# EAGLE design H01 (EAGLE 6.6.0)
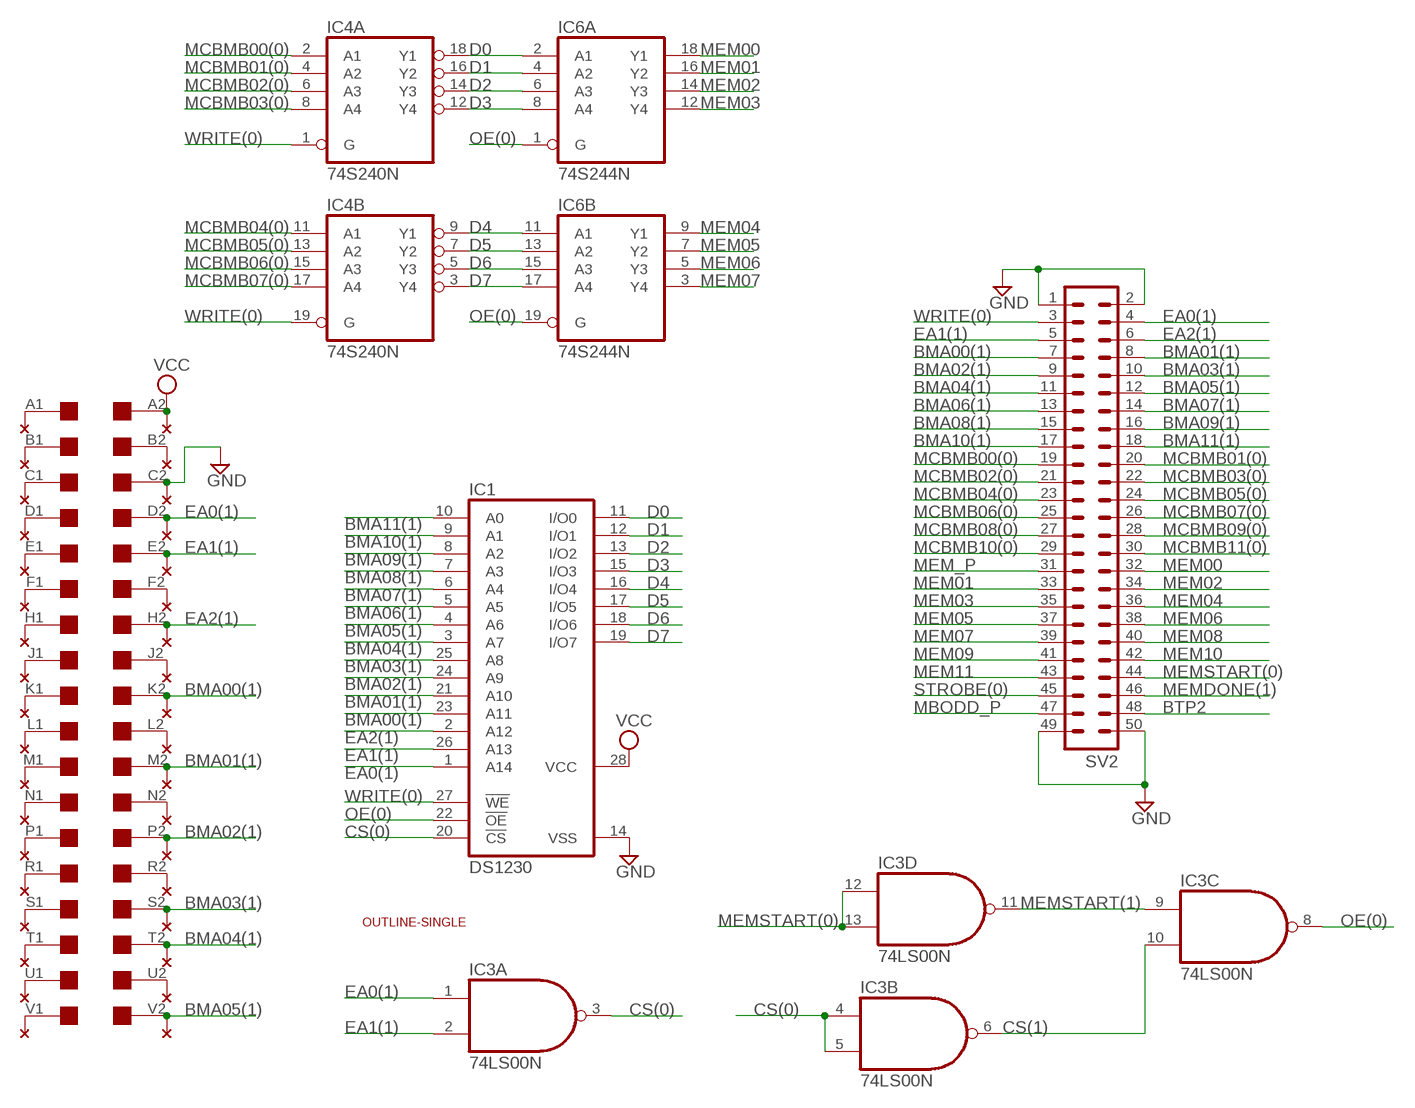
[diagram p0: schematic, sheet 1]

## Parts
EDGE1  EDGE-2CONNECTOR  [EDGE-CON2]
IC1  DS1230  62256P  [DIL28-6]
IC3  74LS00N  [DIL14]
IC4  74S240N  [DIL20]
IC6  74S244N  [DIL20]
SV2  ML50L  [ML50L]
U$2  OUTLINE-SINGLE  [SINGLE]
U$3  THRU-HOLE2  [THRU-HOLEB]

## Nets
BMA00(1): EDGE1.K2 IC1.23(A11) SV2.7 U$3.K2
BMA01(1): EDGE1.M2 IC1.21(A10) SV2.8 U$3.M2
BMA02(1): EDGE1.P2 IC1.24(A9) SV2.9 U$3.P2
BMA03(1): EDGE1.S2 IC1.25(A8) SV2.10 U$3.S2
BMA04(1): EDGE1.T2 IC1.3(A7) SV2.11 U$3.T2
BMA05(1): EDGE1.V2 IC1.4(A6) SV2.12 U$3.V2
BMA06(1): IC1.5(A5) SV2.13
BMA07(1): IC1.6(A4) SV2.14
BMA08(1): IC1.7(A3) SV2.15
BMA09(1): IC1.8(A2) SV2.16
BMA10(1): IC1.9(A1) SV2.17
BMA11(1): IC1.10(A0) SV2.18
BTP2: SV2.48
CS(0): IC1.20(!CS) IC3.3(A:O) IC3.4(B:I0) IC3.5(B:I1)
CS(1): IC3.6(B:O) IC3.10(C:I1)
D0: IC1.11(I/O0) IC4.18(A:Y1) IC6.2(A:A1)
D1: IC1.12(I/O1) IC4.16(A:Y2) IC6.4(A:A2)
D2: IC1.13(I/O2) IC4.14(A:Y3) IC6.6(A:A3)
D3: IC1.15(I/O3) IC4.12(A:Y4) IC6.8(A:A4)
D4: IC1.16(I/O4) IC4.9(B:Y1) IC6.11(B:A1)
D5: IC1.17(I/O5) IC4.7(B:Y2) IC6.13(B:A2)
D6: IC1.18(I/O6) IC4.5(B:Y3) IC6.15(B:A3)
D7: IC1.19(I/O7) IC4.3(B:Y4) IC6.17(B:A4)
EA0(1): EDGE1.D2 IC1.1(A14) IC3.1(A:I0) SV2.4 U$3.D2
EA1(1): EDGE1.E2 IC1.26(A13) IC3.2(A:I1) SV2.5 U$3.E2
EA2(1): EDGE1.H2 IC1.2(A12) SV2.6 U$3.H2
GND: EDGE1.C2 IC1.14(VSS) SV2.1 SV2.2 SV2.49 SV2.50 U$3.C2
MBODD_P: SV2.47
MCBMB00(0): IC4.2(A:A1) SV2.19
MCBMB01(0): IC4.4(A:A2) SV2.20
MCBMB02(0): IC4.6(A:A3) SV2.21
MCBMB03(0): IC4.8(A:A4) SV2.22
MCBMB04(0): IC4.11(B:A1) SV2.23
MCBMB05(0): IC4.13(B:A2) SV2.24
MCBMB06(0): IC4.15(B:A3) SV2.25
MCBMB07(0): IC4.17(B:A4) SV2.26
MCBMB08(0): SV2.27
MCBMB09(0): SV2.28
MCBMB10(0): SV2.29
MCBMB11(0): SV2.30
MEM00: IC6.18(A:Y1) SV2.32
MEM01: IC6.16(A:Y2) SV2.33
MEM02: IC6.14(A:Y3) SV2.34
MEM03: IC6.12(A:Y4) SV2.35
MEM04: IC6.9(B:Y1) SV2.36
MEM05: IC6.7(B:Y2) SV2.37
MEM06: IC6.5(B:Y3) SV2.38
MEM07: IC6.3(B:Y4) SV2.39
MEM08: SV2.40
MEM09: SV2.41
MEM10: SV2.42
MEM11: SV2.43
MEM_P: SV2.31
MEMDONE(1): SV2.46
MEMSTART(0): IC3.12(D:I0) IC3.13(D:I1) SV2.44
MEMSTART(1): IC3.9(C:I0) IC3.11(D:O)
N$1: EDGE1.L2 U$3.L2
N$3: EDGE1.N2 U$3.N2
N$5: EDGE1.R2 U$3.R2
N$9: EDGE1.J2 U$3.J2
N$11: EDGE1.F2 U$3.F2
N$15: EDGE1.U2 U$3.U2
N$17: EDGE1.B2 U$3.B2
N$19: EDGE1.K1 U$3.K1
N$20: EDGE1.L1 U$3.L1
N$21: EDGE1.M1 U$3.M1
N$22: EDGE1.N1 U$3.N1
N$23: EDGE1.P1 U$3.P1
N$24: EDGE1.R1 U$3.R1
N$25: EDGE1.S1 U$3.S1
N$26: EDGE1.T1 U$3.T1
N$27: EDGE1.U1 U$3.U1
N$28: EDGE1.V1 U$3.V1
N$29: EDGE1.J1 U$3.J1
N$30: EDGE1.H1 U$3.H1
N$31: EDGE1.F1 U$3.F1
N$32: EDGE1.E1 U$3.E1
N$33: EDGE1.D1 U$3.D1
N$34: EDGE1.C1 U$3.C1
N$35: EDGE1.B1 U$3.B1
N$36: EDGE1.A1 U$3.A1
OE(0): IC1.22(!OE) IC3.8(C:O) IC6.1(A:G) IC6.19(B:G)
STROBE(0): SV2.45
VCC: EDGE1.A2 IC1.28(VCC) U$3.A2
WRITE(0): IC1.27(!WE) IC4.1(A:G) IC4.19(B:G) SV2.3

## Power pins joined to a net without a drawn wire
GND: IC3.7(P:GND) IC4.10(P:GND) IC6.10(P:GND)
VCC: IC3.14(P:VCC) IC4.20(P:VCC) IC6.20(P:VCC)

## Library data of the parts
EDGE1 = dec-con:EDGE-2: Double-Sided DEC edge connector.
IC1 = memory-hitachi:62256P: MEMORY; OC_FARNELL: unknown; OC_NEWARK: unknown
IC3 = 74xx-us:74*00: Quad 2-input NAND gate
IC4 = 74xx-us:74*240: Octal BUFFER and LINE DRIVER, 3-state
IC6 = 74xx-us:74*244: Octal BUFFER and LINE DRIVER, 3-state
SV2 = con-ml:ML50L: HARTING; OC_FARNELL: unknown; OC_NEWARK: unknown
U$2 = dec-con:OUTLINE-*: Board outlines for DEC boards.
U$3 = dec-con:THRU-HOLE2: Thru-Hole addition to double-sided edge connector.

## Board
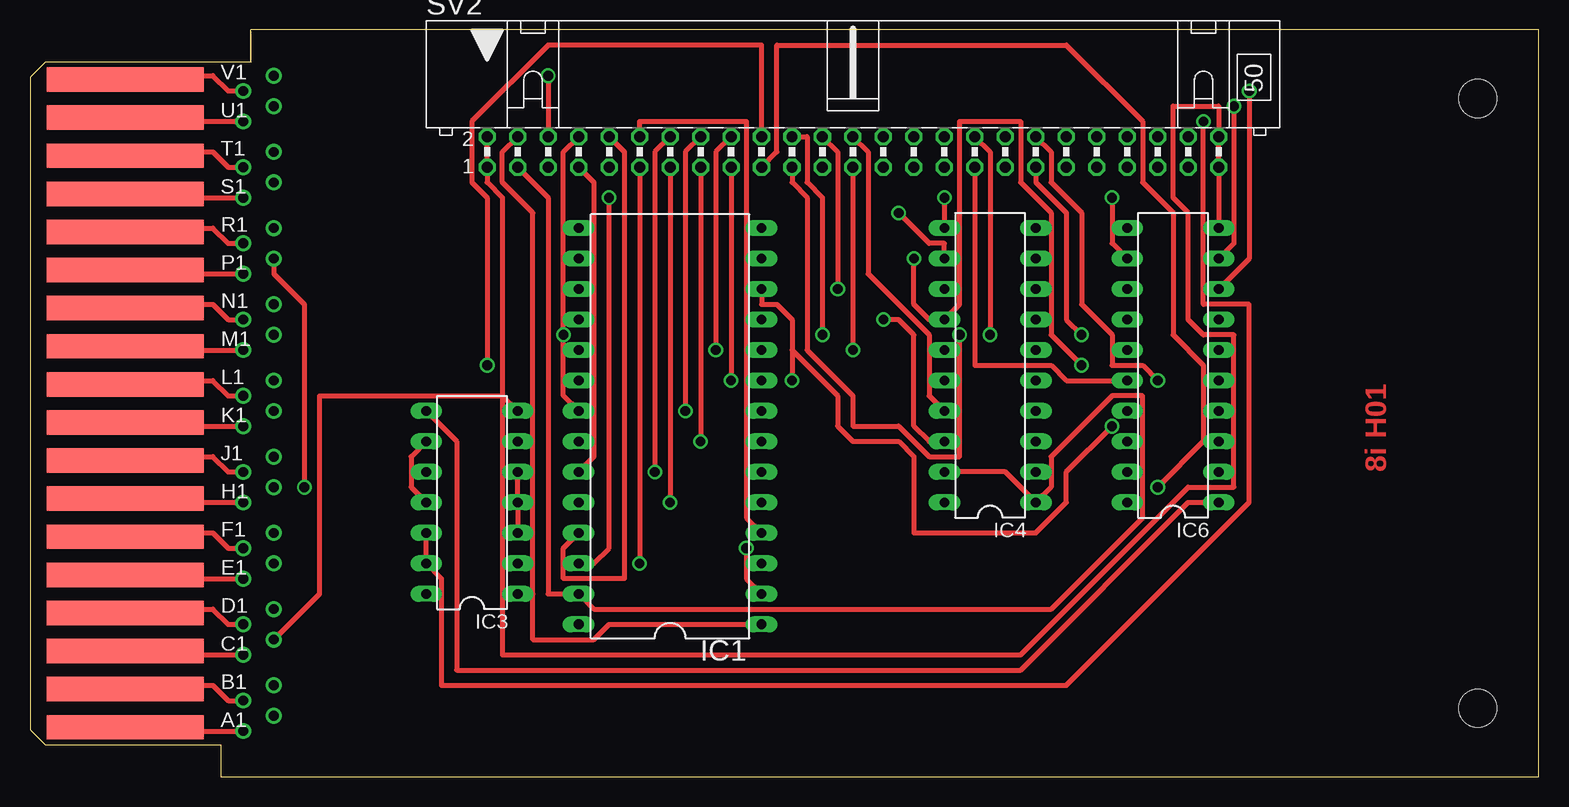
[diagram p1: board, top side]
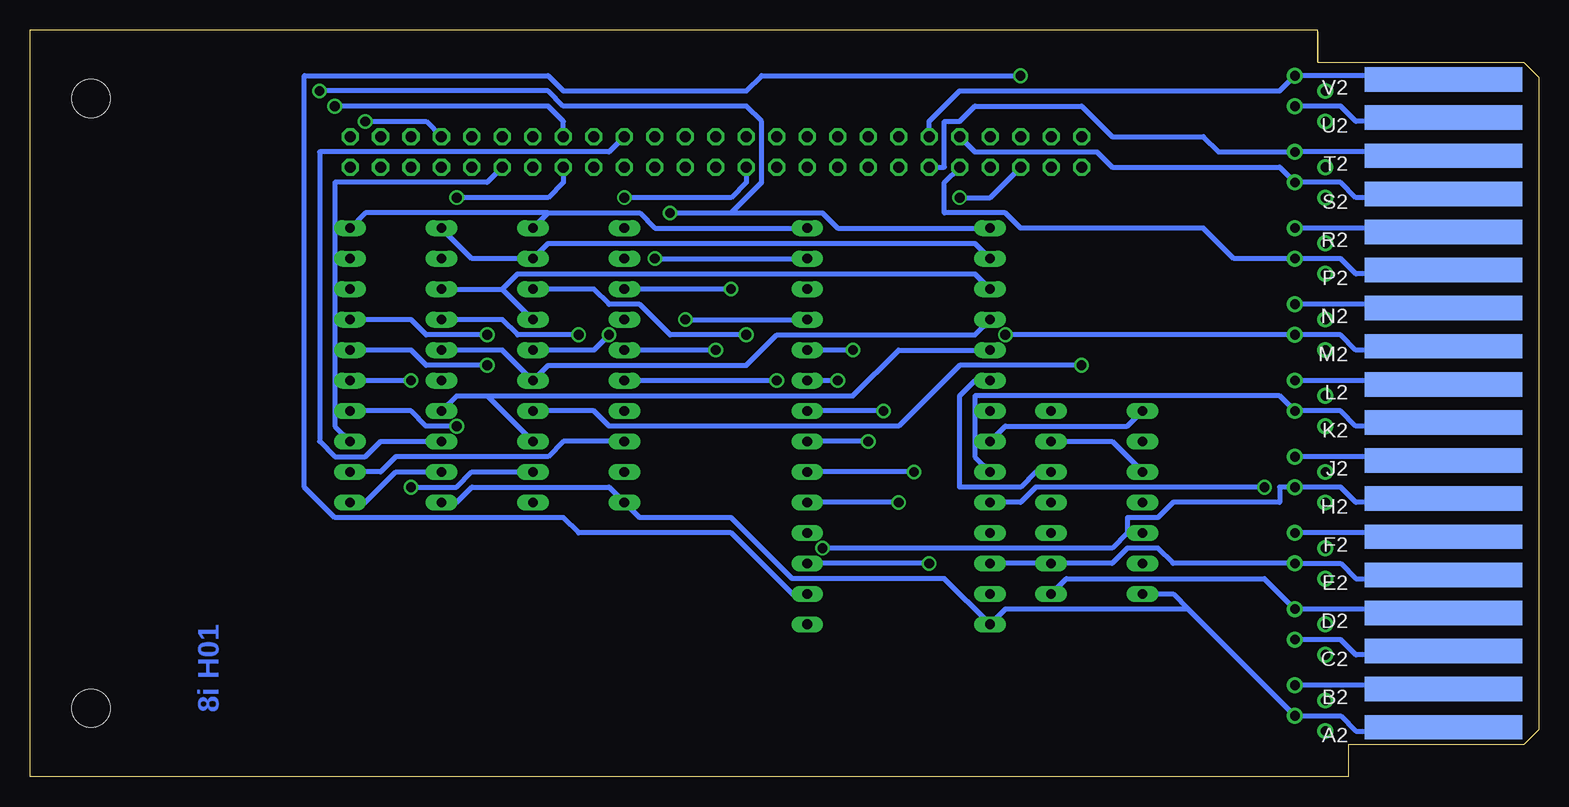
[diagram p2: board, bottom side, seen from below]

Size 125.73 x 62.23 mm. Coordinates in mm from the lower left corner, seen from the top.
Copper layers (1+16): Top 0.035mm / dielectric 1.5mm / Bottom 0.035mm
Design rules "16mils": minimum track width 16mil, minimum drill 32mil, track to track 15mil, track to pad 10mil, pad to pad 10mil, via to via 10mil, smd to smd 10mil, copper to edge 13mil, drill to drill 10mil, minimum pad ring 10mil, minimum via ring 8mil, stop-mask expansion 0mil, vias tented up to drill 0mil, thermal gap 10mil

### Footprints (pad centres in the part's own frame; a part is rotated, then mirrored left to right if it is on the bottom)
EDGE-CON2 = smd 13.106 x 2.032: A1 7.938,4.128; B1 7.938,7.303; C1 7.938,10.477; D1 7.938,13.652; E1 7.938,16.828; F1 7.938,20.003; H1 7.938,23.177; J1 7.938,26.352; K1 7.938,29.527; L1 7.938,32.703; M1 7.938,35.877; N1 7.938,39.053; P1 7.938,42.227; R1 7.938,45.403; S1 7.938,48.578; T1 7.938,51.752; U1 7.938,54.928; V1 7.938,58.102 | smd 13.106 x 2.032 bottom: A2 7.938,4.128; B2 7.938,7.303; C2 7.938,10.477; D2 7.938,13.652; E2 7.938,16.828; F2 7.938,20.003; H2 7.938,23.177; J2 7.938,26.352; K2 7.938,29.527; L2 7.938,32.703; M2 7.938,35.877; N2 7.938,39.053; P2 7.938,42.227; R2 7.938,45.403; S2 7.938,48.578; T2 7.938,51.752; U2 7.938,54.928; V2 7.938,58.102
DIL28-6 = drill 0.813 long: 1 -16.51,-7.62; 2 -13.97,-7.62; 3 -11.43,-7.62; 4 -8.89,-7.62; 5 -6.35,-7.62; 6 -3.81,-7.62; 7 -1.27,-7.62; 8 1.27,-7.62; 9 3.81,-7.62; 10 6.35,-7.62; 11 8.89,-7.62; 12 11.43,-7.62; 13 13.97,-7.62; 14 16.51,-7.62; 15 16.51,7.62; 16 13.97,7.62; 17 11.43,7.62; 18 8.89,7.62; 19 6.35,7.62; 20 3.81,7.62; 21 1.27,7.62; 22 -1.27,7.62; 23 -3.81,7.62; 24 -6.35,7.62; 25 -8.89,7.62; 26 -11.43,7.62; 27 -13.97,7.62; 28 -16.51,7.62
DIL14 = drill 0.813 long: 1 -7.62,-3.81; 2 -5.08,-3.81; 3 -2.54,-3.81; 4 0,-3.81; 5 2.54,-3.81; 6 5.08,-3.81; 7 7.62,-3.81; 8 7.62,3.81; 9 5.08,3.81; 10 2.54,3.81; 11 0,3.81; 12 -2.54,3.81; 13 -5.08,3.81; 14 -7.62,3.81
DIL20 = drill 0.813 long: 1 -11.43,-3.81; 2 -8.89,-3.81; 3 -6.35,-3.81; 4 -3.81,-3.81; 5 -1.27,-3.81; 6 1.27,-3.81; 7 3.81,-3.81; 8 6.35,-3.81; 9 8.89,-3.81; 10 11.43,-3.81; 11 11.43,3.81; 12 8.89,3.81; 13 6.35,3.81; 14 3.81,3.81; 15 1.27,3.81; 16 -1.27,3.81; 17 -3.81,3.81; 18 -6.35,3.81; 19 -8.89,3.81; 20 -11.43,3.81
ML50L = drill 0.914 octagon: 1 -30.48,-1.27; 2 -30.48,1.27; 3 -27.94,-1.27; 4 -27.94,1.27; 5 -25.4,-1.27; 6 -25.4,1.27; 7 -22.86,-1.27; 8 -22.86,1.27; 9 -20.32,-1.27; 10 -20.32,1.27; 11 -17.78,-1.27; 12 -17.78,1.27; 13 -15.24,-1.27; 14 -15.24,1.27; 15 -12.7,-1.27; 16 -12.7,1.27; 17 -10.16,-1.27; 18 -10.16,1.27; 19 -7.62,-1.27; 20 -7.62,1.27; 21 -5.08,-1.27; 22 -5.08,1.27; 23 -2.54,-1.27; 24 -2.54,1.27; 25 0,-1.27; 26 0,1.27; 27 2.54,-1.27; 28 2.54,1.27; 29 5.08,-1.27; 30 5.08,1.27; 31 7.62,-1.27; 32 7.62,1.27; 33 10.16,-1.27; 34 10.16,1.27; 35 12.7,-1.27; 36 12.7,1.27; 37 15.24,-1.27; 38 15.24,1.27; 39 17.78,-1.27; 40 17.78,1.27; 41 20.32,-1.27; 42 20.32,1.27; 43 22.86,-1.27; 44 22.86,1.27; 45 25.4,-1.27; 46 25.4,1.27; 47 27.94,-1.27; 48 27.94,1.27; 49 30.48,-1.27; 50 30.48,1.27
SINGLE = hole 3.175: 120.65,56.515; 120.65,5.715
THRU-HOLEB = drill 0.813 pad 1.27: A1 17.78,3.81; A2 20.32,5.08; B1 17.78,6.35; B2 20.32,7.62; C1 17.78,10.16; C2 20.32,11.43; D1 17.78,12.7; D2 20.32,13.97; E1 17.78,16.51; E2 20.32,17.78; F1 17.78,19.05; F2 20.32,20.32; H1 17.78,22.86; H2 20.32,24.13; J1 17.78,25.4; J2 20.32,26.67; K1 17.78,29.21; K2 20.32,30.48; L1 17.78,31.75; L2 20.32,33.02; M1 17.78,35.56; M2 20.32,36.83; N1 17.78,38.1; N2 20.32,39.37; P1 17.78,41.91; P2 20.32,43.18; R1 17.78,44.45; R2 20.32,45.72; S1 17.78,48.26; S2 20.32,49.53; T1 17.78,50.8; T2 20.32,52.07; U1 17.78,54.61; U2 20.32,55.88; V1 17.78,57.15; V2 20.32,58.42

### Placement (x,y rotation side)
EDGE1  0,0 0 top
IC1  53.34,29.21 90 top
IC3  36.83,22.86 90 top
IC4  80.01,34.29 90 top
IC6  95.25,34.29 90 top
SV2  68.58,52.07 0 top
U$2  0,0 0 top
U$3  0,0 0 top

### Tracks (layer width: path | path; a pad name or v marks a point on that pad's centre or on a via)
BMA00(1)
  Top 0.406: IC1.23 46.99,26.67 46.99,49.53 SV2.7
  Bottom 0.406: EDGE1.K2 8.89,29.21 15.24,29.21 16.51,30.48 U$3.K2 21.59,31.75 46.99,31.75 46.99,26.67 IC1.23
BMA01(1)  (via drill 0.81)
  Top 0.406: SV2.8 44.45,52.07 v44.45,36.83 44.45,31.75 IC1.21
  Bottom 0.406: EDGE1.M2 8.89,35.56 15.24,35.56 16.51,36.83 U$3.M2 v44.45,36.83
BMA02(1)  (via drill 0.81)
  Top 0.406: v22.86,24.13 22.86,39.37 20.32,41.91 U$3.P2
  Bottom 0.406: EDGE1.P2 8.89,41.91 15.24,41.91 16.51,43.18 U$3.P2 25.4,43.18 27.94,45.72 43.18,45.72 44.45,46.99 49.53,46.99 49.53,49.53 SV2.9 | IC1.24 43.18,22.86 41.91,24.13 v22.86,24.13
BMA03(1)
  Top 0.406: IC1.25 44.45,19.05 44.45,16.51 49.53,16.51 49.53,52.07 SV2.10
  Bottom 0.406: EDGE1.S2 8.89,48.26 15.24,48.26 16.51,49.53 U$3.S2 21.59,50.8 35.56,50.8 36.83,52.07 46.99,52.07 SV2.10
BMA04(1)  (via drill 0.81)
  Top 0.406: SV2.11 v50.8,17.78
  Bottom 0.406: EDGE1.T2 8.89,52.07 U$3.T2 26.67,52.07 27.94,53.34 35.56,53.34 38.1,55.88 46.99,55.88 48.26,54.61 49.53,54.61 49.53,50.8 SV2.11 | v50.8,17.78 IC1.3
BMA05(1)
  Top 0.406: IC1.4 59.69,21.59 59.69,54.61 50.8,54.61 SV2.12
  Bottom 0.406: EDGE1.V2 8.89,58.42 U$3.V2 21.59,57.15 48.26,57.15 50.8,54.61 SV2.12
BMA06(1)  (via drill 0.81)
  Top 0.406: SV2.13 v53.34,22.86
  Bottom 0.406: v53.34,22.86 IC1.5
BMA07(1)  (via drill 0.81)
  Top 0.406: v52.07,25.4 52.07,52.07 SV2.14
  Bottom 0.406: v52.07,25.4 IC1.6
BMA08(1)  (via drill 0.81)
  Top 0.406: SV2.15 v55.88,27.94
  Bottom 0.406: v55.88,27.94 IC1.7
BMA09(1)  (via drill 0.81)
  Top 0.406: v54.61,30.48 54.61,52.07 SV2.16
  Bottom 0.406: v54.61,30.48 IC1.8
BMA10(1)  (via drill 0.81)
  Top 0.406: SV2.17 v58.42,33.02
  Bottom 0.406: v58.42,33.02 IC1.9
BMA11(1)  (via drill 0.81)
  Top 0.406: v57.15,35.56 57.15,52.07 SV2.18
  Bottom 0.406: v57.15,35.56 IC1.10
CS(0)
  Top 0.406: IC3.3 IC3.4 IC3.5
  Bottom 0.406: IC1.20 46.99,33.02 48.26,31.75 48.26,24.13 43.18,24.13 41.91,25.4 IC3.5
CS(1)
  Bottom 0.406: IC3.10 35.56,27.94 IC3.6
D0  (via drill 0.81)
  Top 0.406: v71.12,38.1 72.39,38.1 73.66,36.83 73.66,29.21 74.93,27.94 IC4.18
  Bottom 0.406: v71.12,38.1 IC1.11 | IC6.2 96.52,25.4 95.25,26.67 82.55,26.67 81.28,27.94 IC4.18
D1  (via drill 0.81)
  Top 0.406: 63.5,35.56 63.5,38.1 62.23,39.37 60.96,39.37 IC1.12 | 63.5,35.56 v63.5,33.02 | v90.17,29.21 86.36,25.4 86.36,22.86 83.82,20.32 73.66,20.32 73.66,26.67 72.39,27.94 68.58,27.94 67.31,29.21 67.31,31.75 63.5,35.56
  Bottom 0.406: v63.5,33.02 IC4.16 | IC6.4 93.98,30.48 92.71,29.21 v90.17,29.21
D2  (via drill 0.81)
  Top 0.406: v73.66,43.18 73.66,39.37 74.93,38.1 IC4.14 77.47,39.37 77.47,54.61 82.55,54.61 82.55,49.53 85.09,46.99 85.09,36.83 v87.63,34.29
  Bottom 0.406: v73.66,43.18 IC1.13 | IC6.6 93.98,35.56 92.71,34.29 v87.63,34.29
D3  (via drill 0.81)
  Top 0.406: v72.39,46.99 74.93,44.45 76.2,44.45 IC4.12 | IC6.8 101.6,43.18 v101.6,57.15
  Bottom 0.406: IC1.15 58.42,45.72 59.69,46.99 67.31,46.99 | v72.39,46.99 67.31,46.99 | v101.6,57.15 82.55,57.15 81.28,55.88 66.04,55.88 64.77,54.61 64.77,49.53 67.31,46.99
D4
  Bottom 0.406: IC1.16 46.99,44.45 82.55,44.45 IC4.9 88.9,43.18 IC6.11
D5
  Bottom 0.406: 86.36,40.64 IC4.7 | IC6.13 86.36,40.64 | IC1.17 46.99,41.91 85.09,41.91 86.36,40.64
D6
  Bottom 0.406: IC1.18 46.99,36.83 63.5,36.83 66.04,34.29 82.55,34.29 IC4.5 86.36,35.56 IC6.15
D7
  Bottom 0.406: IC1.19 53.34,35.56 57.15,31.75 87.63,31.75 | 87.63,31.75 90.17,31.75 IC6.17 | 87.63,31.75 IC4.3
EA0(1)
  Top 0.406: IC1.1 48.26,12.7 46.99,11.43 41.91,11.43 41.91,15.24 | IC3.1 41.91,15.24 | SV2.4 39.37,52.07 39.37,49.53 41.91,46.99 41.91,15.24
  Bottom 0.406: EDGE1.D2 8.89,13.97 U$3.D2 22.86,16.51 39.37,16.51 IC3.1
EA1(1)  (via drill 0.81)
  Top 0.406: v48.26,48.26 48.26,19.05 46.99,17.78 IC1.26
  Bottom 0.406: IC1.26 IC3.2 35.56,17.78 34.29,19.05 31.75,19.05 30.48,17.78 U$3.E2 16.51,17.78 15.24,16.51 8.89,16.51 EDGE1.E2 | SV2.5 45.72,48.26 v48.26,48.26
EA2(1)  (via drill 0.81)
  Top 0.406: IC1.2 59.69,16.51 v59.69,19.05 | v43.18,58.42 SV2.6
  Bottom 0.406: EDGE1.H2 8.89,22.86 15.24,22.86 16.51,24.13 U$3.H2 21.59,24.13 21.59,22.86 30.48,22.86 31.75,21.59 34.29,21.59 34.29,20.32 35.56,19.05 v59.69,19.05 | v43.18,58.42 64.77,58.42 66.04,57.15 81.28,57.15 82.55,58.42 102.87,58.42 102.87,24.13 100.33,21.59 81.28,21.59 80.01,20.32 67.31,20.32 62.23,15.24 IC1.2
GND
  Top 0.406: IC6.10 SV2.49 SV2.50 99.06,55.88 95.25,55.88 95.25,48.26 96.52,46.99 96.52,38.1 97.79,36.83 100.33,36.83 100.33,24.13 96.52,24.13 82.55,10.16 39.37,10.16 39.37,31.75 | 39.37,31.75 IC3.7 | 39.37,31.75 39.37,48.26 38.1,49.53 SV2.1 SV2.2 | 39.37,31.75 24.13,31.75 24.13,15.24 U$3.C2
  Bottom 0.406: IC1.14 73.66,45.72 74.93,46.99 82.55,46.99 | IC4.10 82.55,46.99 | IC6.10 97.79,46.99 82.55,46.99 | U$3.C2 16.51,11.43 15.24,10.16 8.89,10.16 EDGE1.C2
MCBMB00(0)  (via drill 0.81)
  Top 0.406: v93.98,24.13 97.79,27.94 97.79,34.29 95.25,36.83 95.25,46.99 92.71,49.53 92.71,54.61 86.36,60.96 62.23,60.96 62.23,52.07 SV2.19
  Bottom 0.406: IC4.2 88.9,25.4 90.17,24.13 v93.98,24.13
MCBMB01(0)  (via drill 0.81)
  Top 0.406: v38.1,34.29 38.1,48.26 36.83,49.53 36.83,54.61 43.18,60.96 60.96,60.96 SV2.20
  Bottom 0.406: IC4.4 78.74,30.48 77.47,29.21 53.34,29.21 48.26,34.29 v38.1,34.29
MCBMB02(0)  (via drill 0.81)
  Top 0.406: v77.47,36.83 77.47,26.67 74.93,26.67 72.39,29.21 68.58,29.21 68.58,31.75 64.77,35.56 64.77,48.26 63.5,49.53 SV2.21
  Bottom 0.406: IC4.6 78.74,35.56 v77.47,36.83
MCBMB03(0)  (via drill 0.81)
  Top 0.406: v66.04,36.83 66.04,48.26 64.77,49.53 64.77,53.34 SV2.22
  Bottom 0.406: IC4.8 78.74,40.64 77.47,39.37 74.93,39.37 72.39,36.83 v66.04,36.83
MCBMB04(0)  (via drill 0.81)
  Top 0.406: v76.2,48.26 IC4.11
  Bottom 0.406: v76.2,48.26 67.31,48.26 66.04,49.53 SV2.23
MCBMB05(0)  (via drill 0.81)
  Top 0.406: v67.31,40.64 67.31,52.07 SV2.24
  Bottom 0.406: v67.31,40.64 IC4.13
MCBMB06(0)  (via drill 0.81)
  Top 0.406: SV2.25 v68.58,35.56
  Bottom 0.406: v68.58,35.56 IC4.15
MCBMB07(0)
  Top 0.406: IC4.17 74.93,31.75 74.93,36.83 69.85,41.91 69.85,52.07 SV2.26
MEM00
  Bottom 0.406: IC6.18 96.52,27.94 97.79,26.67 100.33,26.67 101.6,27.94 101.6,52.07 77.47,52.07 SV2.32
MEM01
  Top 0.406: IC6.16 86.36,33.02 85.09,34.29 78.74,34.29 SV2.33
MEM02  (via drill 0.81)
  Top 0.406: v80.01,36.83 80.01,52.07 SV2.34
  Bottom 0.406: IC6.14 86.36,38.1 85.09,36.83 v80.01,36.83
MEM03  (via drill 0.81)
  Top 0.406: IC6.12 90.17,44.45 v90.17,48.26
  Bottom 0.406: v90.17,48.26 82.55,48.26 81.28,49.53 SV2.35
MEM04  (via drill 0.81)
  Top 0.406: IC6.9 100.33,44.45 v100.33,55.88
  Bottom 0.406: v100.33,55.88 82.55,55.88 81.28,54.61 SV2.36
MEM05  (via drill 0.81)
  Top 0.406: v87.63,36.83 86.36,38.1 86.36,46.99 83.82,49.53 SV2.37
  Bottom 0.406: IC6.7 93.98,38.1 92.71,36.83 v87.63,36.83
MEM06  (via drill 0.81)
  Top 0.406: v93.98,33.02 92.71,34.29 90.17,34.29 90.17,36.83 87.63,39.37 87.63,46.99 85.09,49.53 85.09,52.07 SV2.38
  Bottom 0.406: v93.98,33.02 IC6.5
MEM07
  Bottom 0.406: IC6.3 100.33,29.21 100.33,49.53 87.63,49.53 SV2.39
MEMSTART(0)  (via drill 0.81)
  Top 0.406: IC3.12 IC3.13 34.29,16.51 34.29,7.62 86.36,7.62 101.6,22.86 101.6,39.37 97.79,39.37 v97.79,54.61
  Bottom 0.406: SV2.44 92.71,54.61 v97.79,54.61
MEMSTART(1)
  Top 0.406: IC3.11 31.75,24.13 31.75,26.67 IC3.9
N$1
  Bottom 0.406: U$3.L2 8.89,33.02 EDGE1.L2
N$3
  Bottom 0.406: U$3.N2 8.89,39.37 EDGE1.N2
N$5
  Bottom 0.406: U$3.R2 8.89,45.72 EDGE1.R2
N$9
  Bottom 0.406: U$3.J2 8.89,26.67 EDGE1.J2
N$11
  Bottom 0.406: U$3.F2 8.89,20.32 EDGE1.F2
N$15
  Bottom 0.406: U$3.U2 16.51,55.88 15.24,54.61 8.89,54.61 EDGE1.U2
N$17
  Bottom 0.406: U$3.B2 8.89,7.62 EDGE1.B2
N$19
  Top 0.406: U$3.K1 8.89,29.21 EDGE1.K1
N$20
  Top 0.406: U$3.L1 16.51,31.75 15.24,33.02 8.89,33.02 EDGE1.L1
N$21
  Top 0.406: U$3.M1 8.89,35.56 EDGE1.M1
N$22
  Top 0.406: U$3.N1 16.51,38.1 15.24,39.37 8.89,39.37 EDGE1.N1
N$23
  Top 0.406: U$3.P1 8.89,41.91 EDGE1.P1
N$24
  Top 0.406: U$3.R1 16.51,44.45 15.24,45.72 8.89,45.72 EDGE1.R1
N$25
  Top 0.406: U$3.S1 8.89,48.26 EDGE1.S1
N$26
  Top 0.406: U$3.T1 16.51,50.8 15.24,52.07 8.89,52.07 EDGE1.T1
N$27
  Top 0.406: U$3.U1 8.89,54.61 EDGE1.U1
N$28
  Top 0.406: U$3.V1 16.51,57.15 15.24,58.42 8.89,58.42 EDGE1.V1
N$29
  Top 0.406: U$3.J1 16.51,25.4 15.24,26.67 8.89,26.67 EDGE1.J1
N$30
  Top 0.406: U$3.H1 8.89,22.86 EDGE1.H1
N$31
  Top 0.406: U$3.F1 16.51,19.05 15.24,20.32 8.89,20.32 EDGE1.F1
N$32
  Top 0.406: U$3.E1 8.89,16.51 EDGE1.E1
N$33
  Top 0.406: U$3.D1 16.51,12.7 15.24,13.97 8.89,13.97 EDGE1.D1
N$34
  Top 0.406: U$3.C1 8.89,10.16 EDGE1.C1
N$35
  Top 0.406: U$3.B1 16.51,6.35 15.24,7.62 8.89,7.62 EDGE1.B1
N$36
  Top 0.406: U$3.A1 8.89,3.81 EDGE1.A1
OE(0)
  Top 0.406: IC6.1 96.52,22.86 82.55,8.89 35.56,8.89 35.56,27.94 IC3.8
  Bottom 0.406: IC6.19 95.25,25.4 97.79,22.86 IC6.1 | IC3.8 34.29,29.21 44.45,29.21 IC1.22
VCC
  Bottom 0.406: IC6.20 90.17,22.86 88.9,24.13 77.47,24.13 IC4.20 74.93,21.59 67.31,21.59 62.23,16.51 49.53,16.51 IC1.28 44.45,13.97 29.21,13.97 | 29.21,13.97 30.48,15.24 IC3.14 | 29.21,13.97 U$3.A2 16.51,5.08 15.24,3.81 8.89,3.81 EDGE1.A2
WRITE(0)
  Top 0.406: IC4.19 81.28,25.4 IC4.1 85.09,24.13 85.09,26.67 90.17,31.75 92.71,31.75 92.71,21.59 85.09,13.97 46.99,13.97 IC1.27 43.18,15.24 43.18,48.26 SV2.3

### Text on the board
Top: 8i H01
Bottom: 8i H01
tValues: 8i H01